# Altium schematic sheet SOC_MAC_SAR_I2S.schdoc: =
size A3; Symbol: Sheet-Symbol_A4; Company: 嘉立创EDA; Version: V1.0; Page Size: A4; @Project Name: RK3568_LPD4X_120P_Core; @Page Count: 18; @Update Date: 2025-08-22; @Create Date: 2025-08-15; @Schematic Name: Schematic1; @Page No: 9; @Page Name: SOC_MAC/SAR/I2S; Device: Sheet-Symbol_A4; Border: 1; Title Block Position: 3; Width: 1655; Height: 1170; Region Start: 1; X Region Count: 6; Y Region Count: 4; Blade Width: 10; @Board Name: Board1; @Create Time: 14:20:47; @Update Time: 20:07:26; Organization: ORGANIZATION; Address1: ADDRESS 1; Address2: ADDRESS 2; Address3: ADDRESS 3; Address4: ADDRESS 4; SheetNumber: 15; SheetTotal: 28
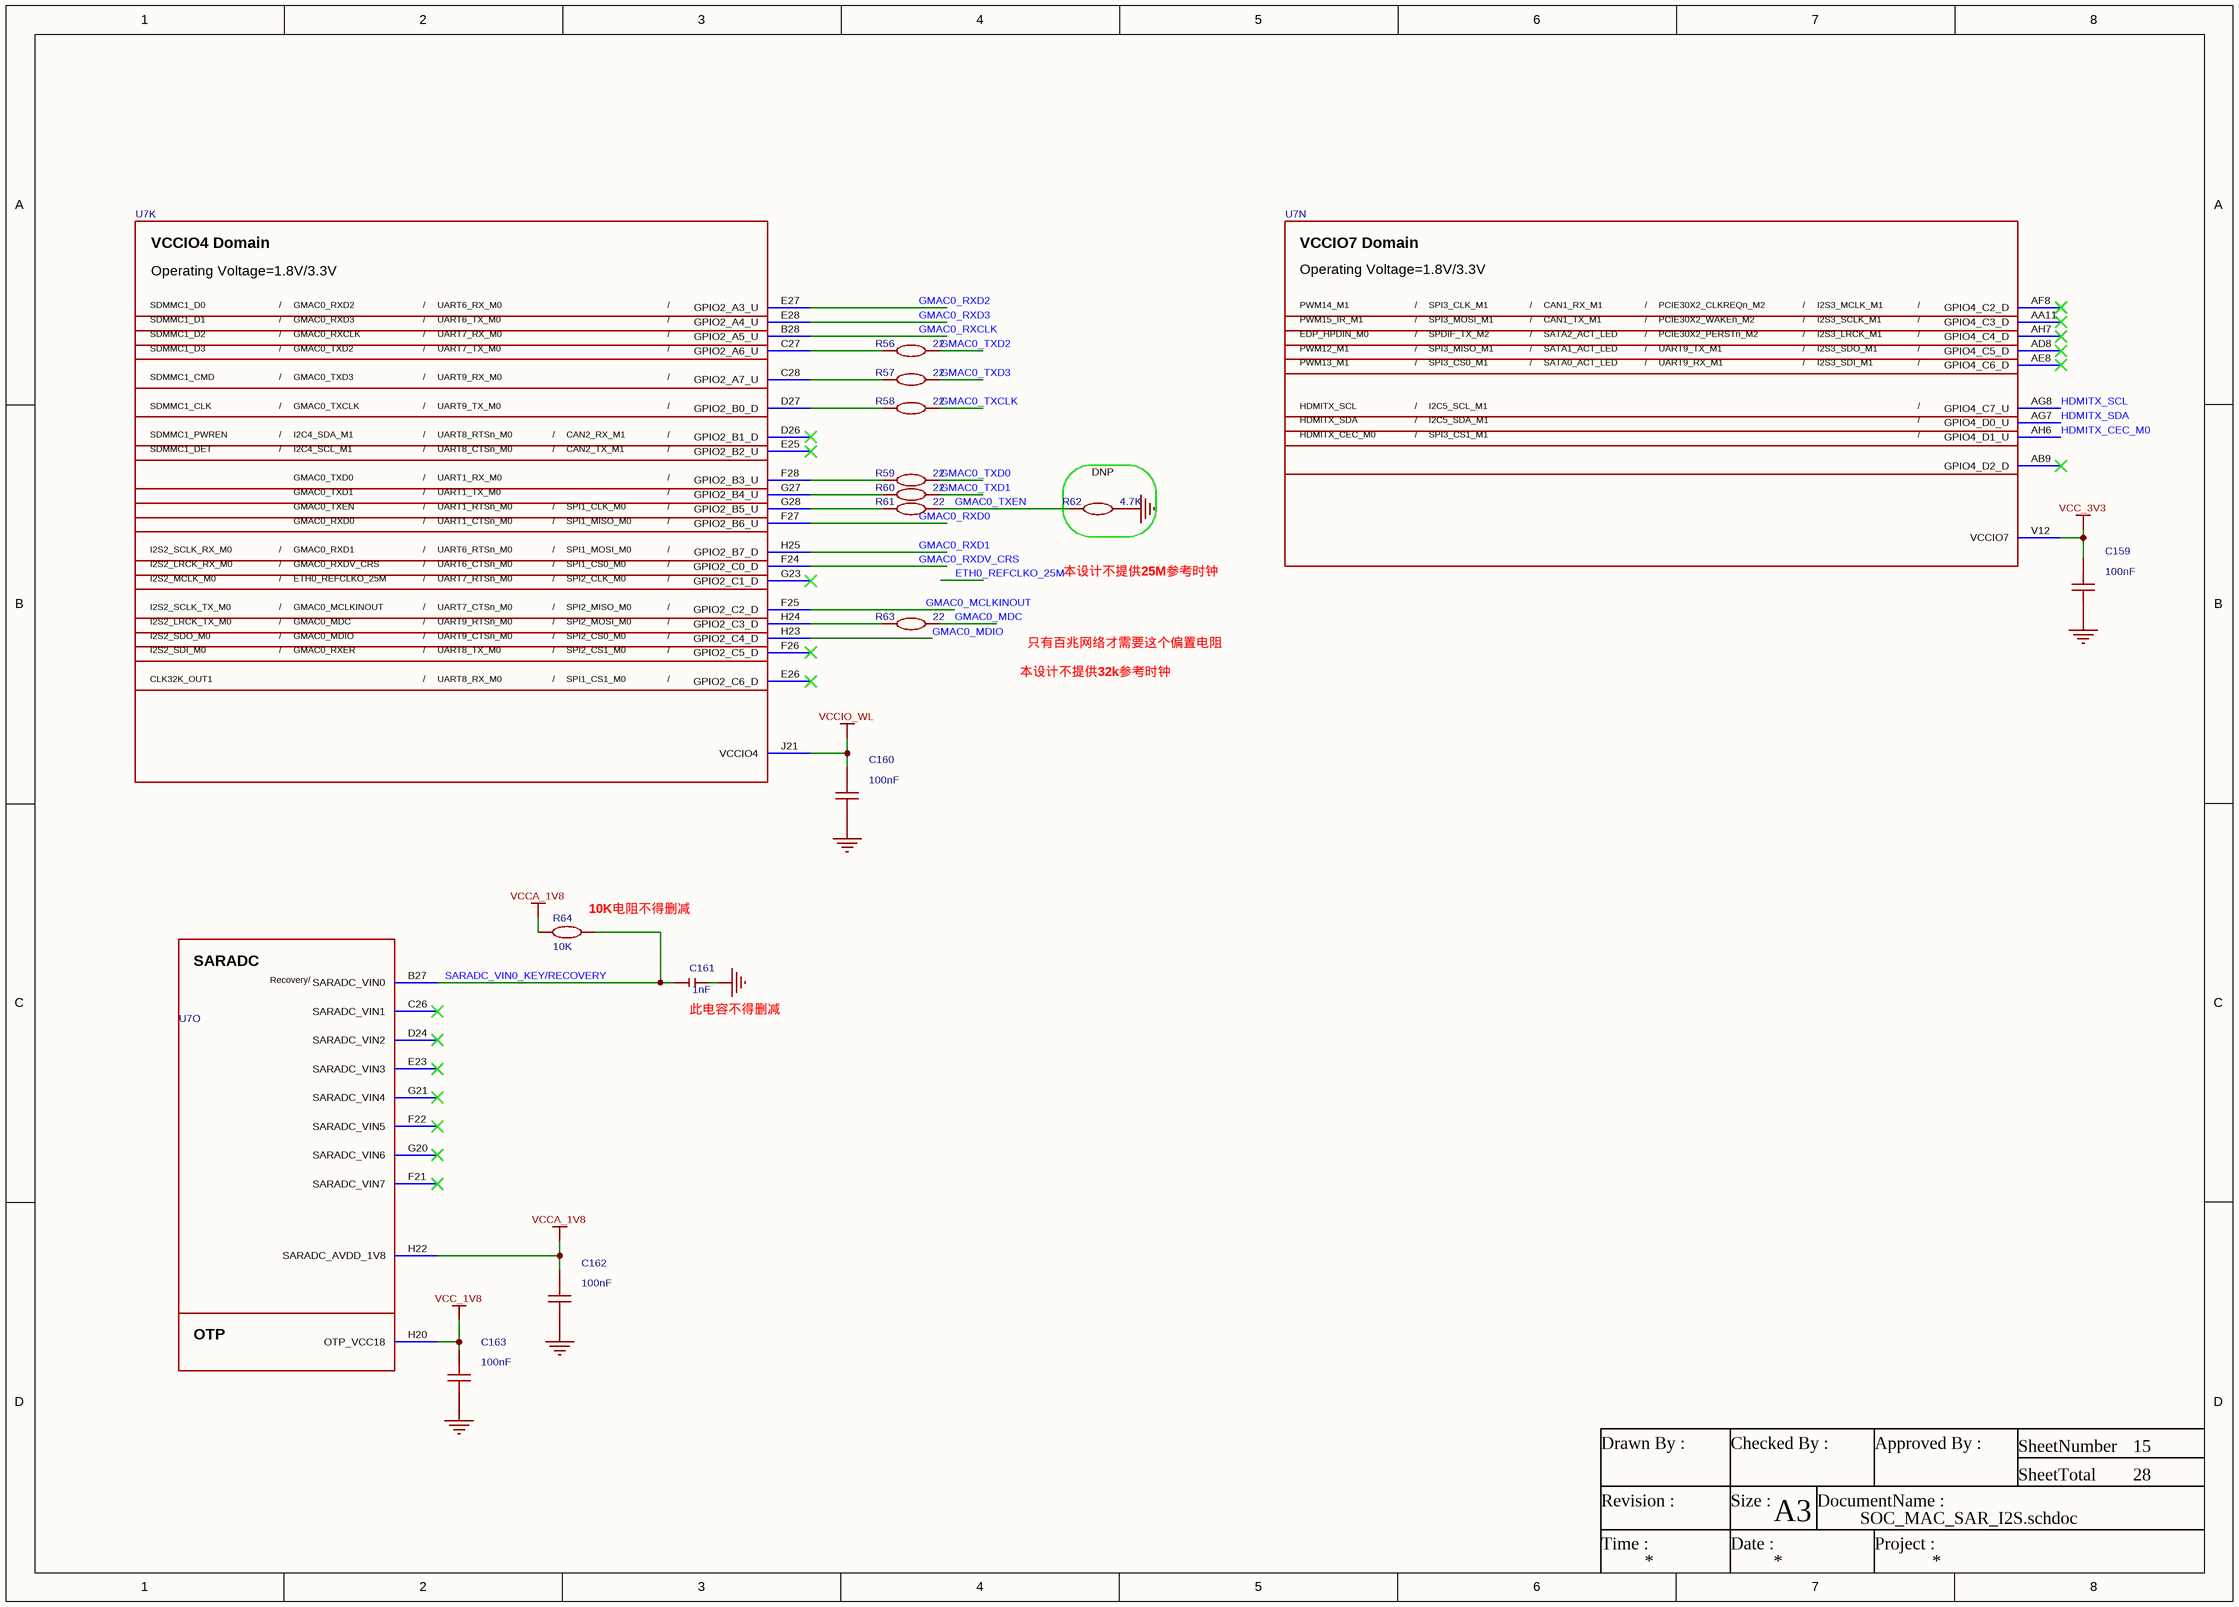
[diagram p0: SOC_MAC_SAR_I2S.schdoc]

## Parts
C159  100nF  [C0201]
C160  100nF  [C0201]
C161  1nF  [MYC0402]
C162  100nF  [C0201]
C163  100nF  [C0201]
R56  22  [R0402]
R57  22  [R0402]
R58  22  [R0402]
R59  22  [R0402]
R60  22  [R0402]
R61  22  [R0402]
R62  4.7K  [R0402]  (no BOM)
R63  22  [R0402]
R64  10K  [R0402]
U7  RK3568  [BGA-636_L19.0-W19.0-P0.65-BL]  (value not drawn)  (parts K,N,O of 23)

## Blocks framed on the sheet
DNP: R62

## Nets
GND: C159.1 C160.1 C161.2 C162.1 C163.1 R62.2
VCC_1V8: C163.2 U7.H20(OTP_VCC18)
VCC_3V3: C159.2 U7.V12(VCCIO7)
VCCA_1V8: C162.2 R64.1 U7.H22(SARADC_AVDD_1V8)
VCCIO_WL: C160.2 U7.J21(VCCIO4)
GMAC0_MCLKINOUT: U7.F25(GPIO2_C2_D)
GMAC0_MDC: R63.2
GMAC0_MDIO: U7.H23(GPIO2_C4_D)
GMAC0_RXCLK: U7.B28(GPIO2_A5_U)
GMAC0_RXD0: U7.F27(GPIO2_B6_U)
GMAC0_RXD1: U7.H25(GPIO2_B7_D)
GMAC0_RXD2: U7.E27(GPIO2_A3_U)
GMAC0_RXD3: U7.E28(GPIO2_A4_U)
GMAC0_RXDV_CRS: U7.F24(GPIO2_C0_D)
GMAC0_TXCLK: R58.2
GMAC0_TXD0: R59.2
GMAC0_TXD1: R60.2
GMAC0_TXD2: R56.2
GMAC0_TXD3: R57.2
GMAC0_TXEN: R61.2 R62.1
HDMITX_CEC_M0: U7.AH6(GPIO4_D1_U)
HDMITX_SCL: U7.AG8(GPIO4_C7_U)
HDMITX_SDA: U7.AG7(GPIO4_D0_U)
SARADC_VIN0_KEY/RECOVERY: C161.1 R64.2 U7.B27(SARADC_VIN0)
NetR56_1: R56.1 U7.C27(GPIO2_A6_U)
NetR57_1: R57.1 U7.C28(GPIO2_A7_U)
NetR58_1: R58.1 U7.D27(GPIO2_B0_D)
NetR59_1: R59.1 U7.F28(GPIO2_B3_U)
NetR60_1: R60.1 U7.G27(GPIO2_B4_U)
NetR61_1: R61.1 U7.G28(GPIO2_B5_U)
NetR63_1: R63.1 U7.H24(GPIO2_C3_D)

Not connected (* = marked no-connect by the designer): U7 AA11(GPIO4_C3_D)* AB9(GPIO4_D2_D)* AD8(GPIO4_C5_D)* AE8(GPIO4_C6_D)* AF8(GPIO4_C2_D)* AH7(GPIO4_C4_D)* C26(SARADC_VIN1)* D24(SARADC_VIN2)* D26(GPIO2_B1_D)* E23(SARADC_VIN3)* E25(GPIO2_B2_U)* E26(GPIO2_C6_D)* F21(SARADC_VIN7)* F22(SARADC_VIN5)* F26(GPIO2_C5_D)* G20(SARADC_VIN6)* G21(SARADC_VIN4)* G23(GPIO2_C1_D)*

## Notes on the sheet
- (near R62) 本设计不提供25M参考时钟
- 本设计不提供32k参考时钟
- 只有百兆网络才需要这个偏置电阻
- (near R64) 10K电阻不得删减
- (near C161) 此电容不得删减
- Drawn By :
- Checked By :
- Approved By :
- SheetNumber
- SheetTotal
- Revision :
- Time :
- Size :
- Date :
- A3
- DocumentName :
- Project :
- (in symbol RK3568, part K) VCCIO4 Domain; Operating Voltage=1.8V/3.3V; SDMMC1_D0; /; GMAC0_RXD2; UART6_RX_M0; SDMMC1_D1; GMAC0_RXD3; UART6_TX_M0; SDMMC1_D2; GMAC0_RXCLK; UART7_RX_M0; SDMMC1_D3; GMAC0_TXD2; UART7_TX_M0; SDMMC1_CMD; GMAC0_TXD3; UART9_RX_M0; SDMMC1_CLK; GMAC0_TXCLK; UART9_TX_M0; SDMMC1_PWREN; I2C4_SDA_M1; UART8_RTSn_M0; CAN2_RX_M1; SDMMC1_DET; I2C4_SCL_M1; UART8_CTSn_M0; CAN2_TX_M1; GMAC0_TXD0; UART1_RX_M0; GMAC0_TXD1; UART1_TX_M0; GMAC0_TXEN; UART1_RTSn_M0; SPI1_CLK_M0; GMAC0_RXD0; UART1_CTSn_M0; SPI1_MISO_M0; I2S2_SCLK_RX_M0; GMAC0_RXD1; UART6_RTSn_M0; SPI1_MOSI_M0; I2S2_LRCK_RX_M0; GMAC0_RXDV_CRS; UART6_CTSn_M0; SPI1_CS0_M0; I2S2_MCLK_M0; ETH0_REFCLKO_25M; UART7_RTSn_M0; SPI2_CLK_M0; I2S2_SCLK_TX_M0; GMAC0_MCLKINOUT; UART7_CTSn_M0; SPI2_MISO_M0; I2S2_LRCK_TX_M0; GMAC0_MDC; UART9_RTSn_M0; SPI2_MOSI_M0; I2S2_SDO_M0; GMAC0_MDIO; UART9_CTSn_M0; SPI2_CS0_M0; I2S2_SDI_M0; GMAC0_RXER; UART8_TX_M0; SPI2_CS1_M0; CLK32K_OUT1; UART8_RX_M0; SPI1_CS1_M0
- (in symbol RK3568, part N) VCCIO7 Domain; Operating Voltage=1.8V/3.3V; PWM14_M1; /; SPI3_CLK_M1; CAN1_RX_M1; PCIE30X2_CLKREQn_M2; I2S3_MCLK_M1; PWM15_IR_M1; SPI3_MOSI_M1; CAN1_TX_M1; PCIE30X2_WAKEn_M2; I2S3_SCLK_M1; EDP_HPDIN_M0; SPDIF_TX_M2; SATA2_ACT_LED; PCIE30X2_PERSTn_M2; I2S3_LRCK_M1; PWM12_M1; SPI3_MISO_M1; SATA1_ACT_LED; UART9_TX_M1; I2S3_SDO_M1; PWM13_M1; SPI3_CS0_M1; SATA0_ACT_LED; UART9_RX_M1; I2S3_SDI_M1; HDMITX_SCL; I2C5_SCL_M1; HDMITX_SDA; I2C5_SDA_M1; HDMITX_CEC_M0; SPI3_CS1_M1
- (in symbol RK3568, part O) SARADC; Recovery/; OTP

## Library data of the parts
C159 C160 C162 C163 = GRM035R60J475ME15D: 容值:4.7uF;精度:±20%;额定电压:6.3V;温度系数:X5R;; Manufacturer: muRata(村田); AddInBom: yes; ModelId: e8033a7cb35143ffb28e3b81b2577ea0; ModelName: C0201_L0.6-W0.3-H0.3; ModelTransform: 23.622,11.811,0,0,0,0,0,0,0; Tolerance: ±20%; Voltage Rating: 6.3V; Temperature Coefficient: X5R; Symbol: GRM035R60J475ME15D; Value: 100nF; Device: GRM035R60J475ME15D; LCSC Part Name: 4.7uF ±20% 6.3V; ManufacturerPart: GRM035R60J475ME15D; Supplier Footprint: 0201; JLCPCB Part Class: Extended Part; Datasheet: https://item.szlcsc.com/datasheet/GRM035R60J475ME15D/313624.html; Supplier: LCSC; ConvertToPcb: yes; FootprintName: C0201
C161 = MYC0402: C0402电容; Symbol: MY_C0201; AddInBom: yes; Device: MYC0402; Value: 1nF; ConvertToPcb: yes; FootprintName: MYC0402
R56-R61 R63 R64 = Res_0402: Symbol: 电阻; 3D Model: 671aefced39d4c318694bba8bd8efd39; 3D Model Transform: 39.37,19.685,0,0,0,0,0,0.0005,0; ConvertToPcb: yes; ModelName: R0402_L1.0-W0.5-H0.5; Device: Res_0402; Supplier Footprint: 0402; AddInBom: yes; FootprintName: R0402
  R56-R61 R63: Value: 22
  R64: Value: 10K
R62 = Res_0402: Symbol: 电阻; 3D Model: 671aefced39d4c318694bba8bd8efd39; 3D Model Transform: 39.37,19.685,0,0,0,0,0,0.0005,0; Add into BOM: no; ConvertToPcb: yes; ModelName: R0402_L1.0-W0.5-H0.5; Device: Res_0402; Supplier Footprint: 0402; Value: 4.7K; FootprintName: R0402
U7 = RK3568: ConvertToPcb: yes; ModelId: e6756cba1b9f43448429fdcd1d44d9d9; ModelTransform: 748.03,748.03,54.33,0,0,0,0,0,0; Symbol: RK3568; Device: RK3568; AddInBom: yes; FootprintName: BGA-636_L19.0-W19.0-P0.65-BL; ModelName: BGA-636_L19.0-W19.0-P0.65-BL